# Altium schematic sheet 06_MSM8916_EBIO LPDDR3.SchDoc
size 868 x 576 mm
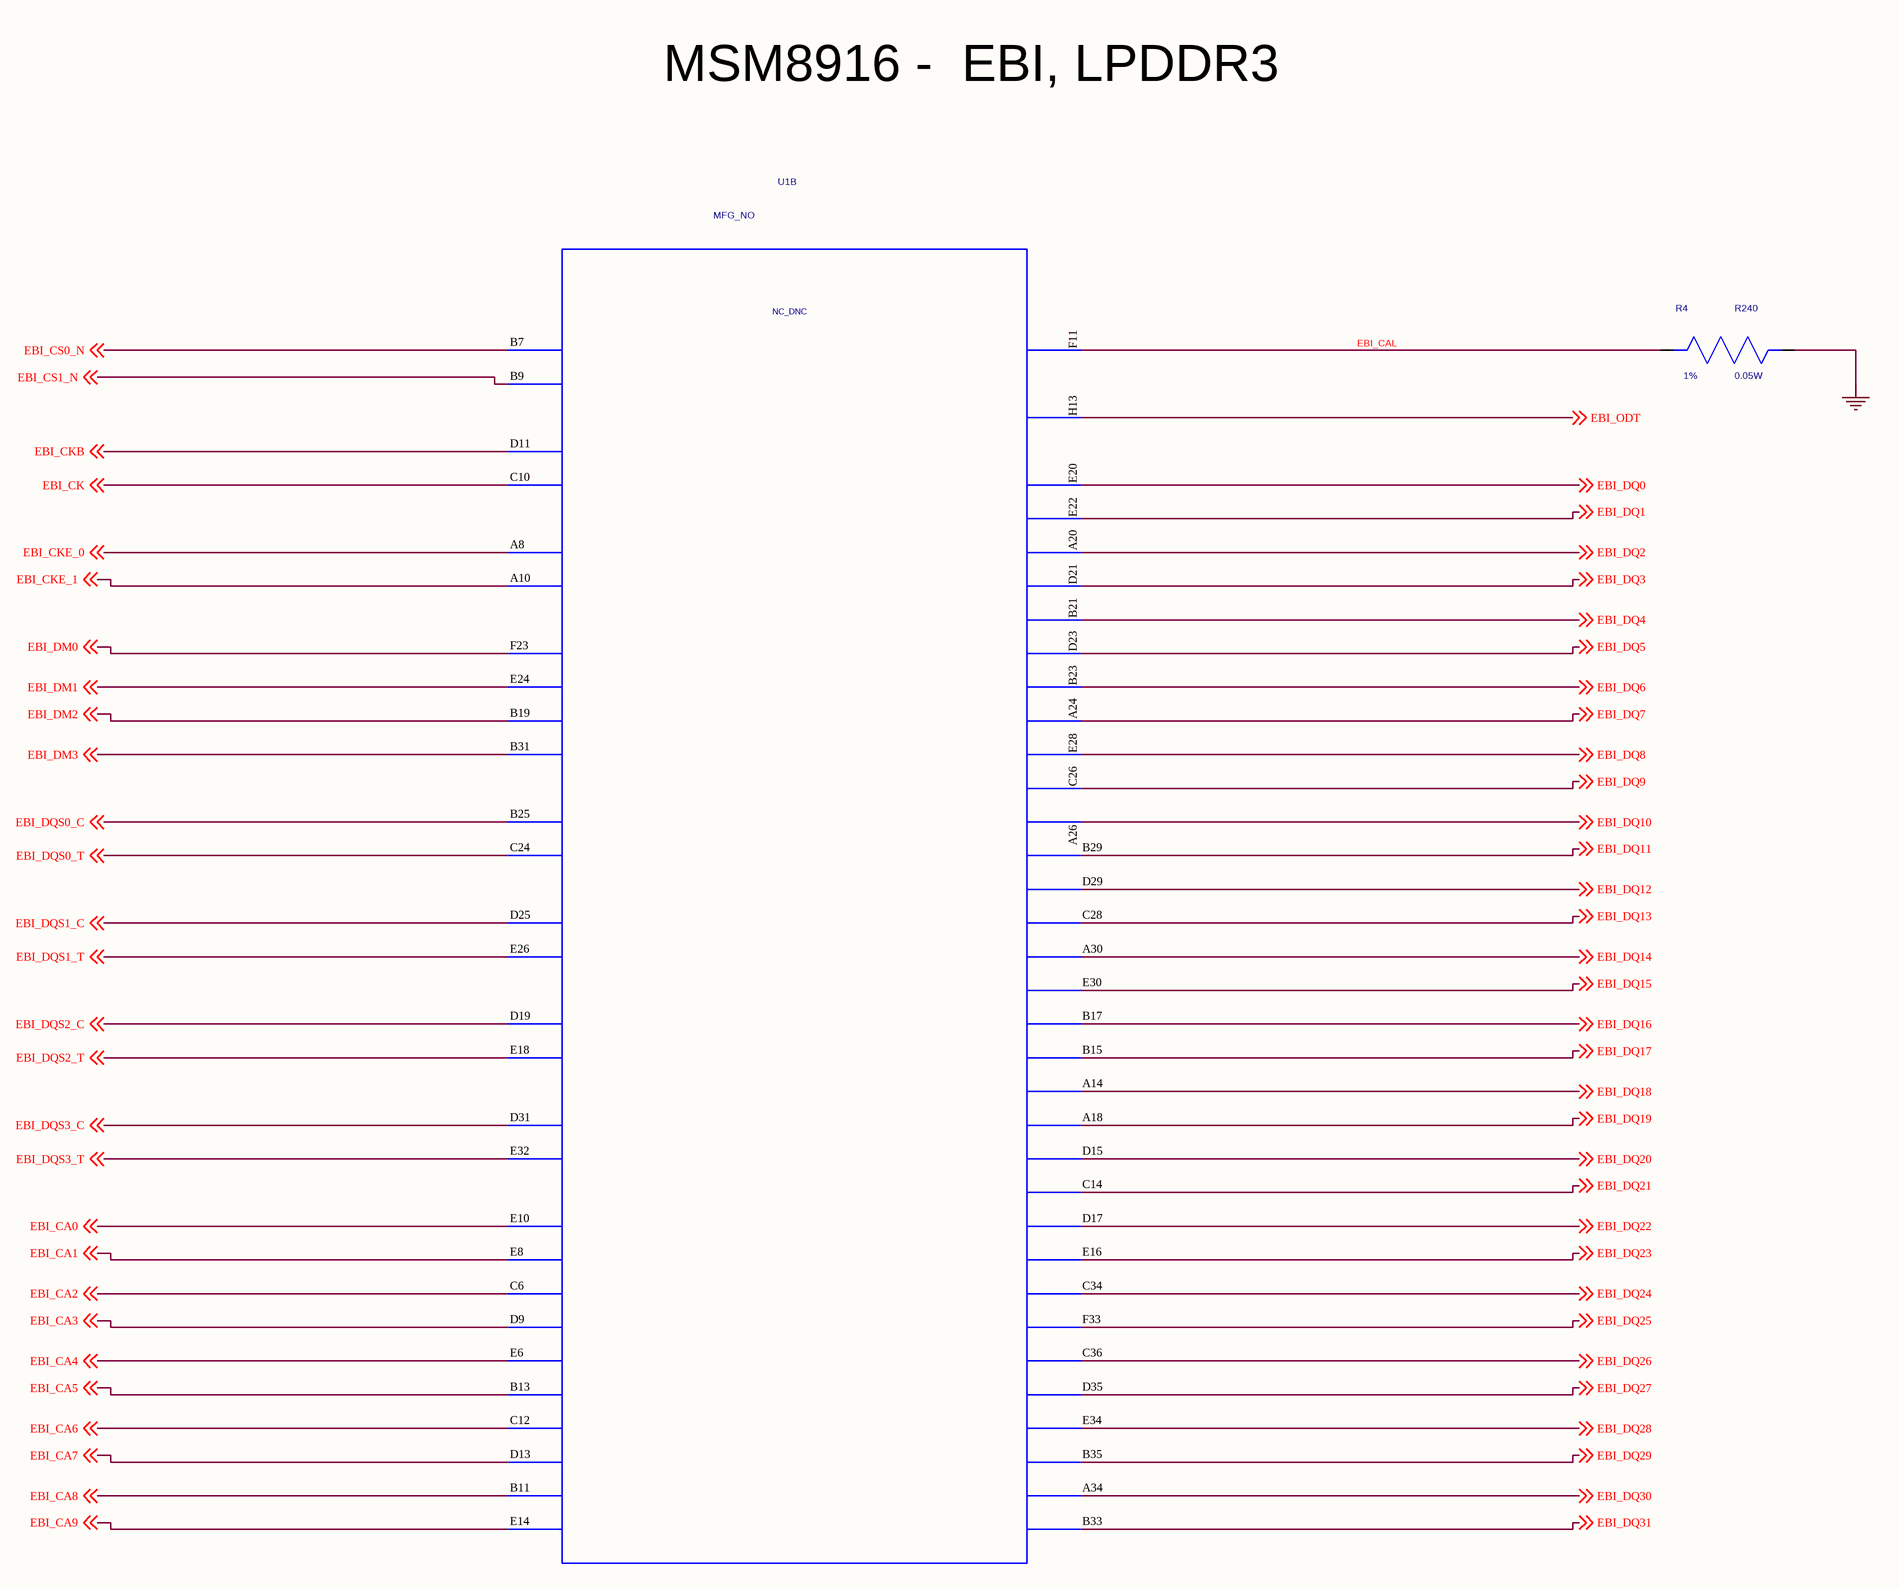
[diagram p0: 06_MSM8916_EBIO LPDDR3.SchDoc, top left]
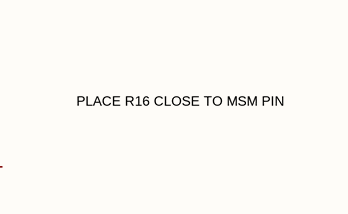
[diagram p1: 06_MSM8916_EBIO LPDDR3.SchDoc, top right]
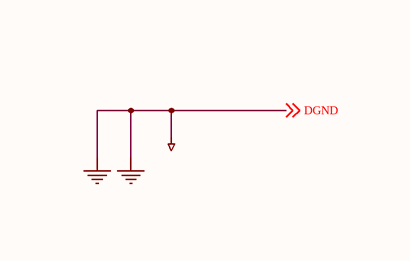
[diagram p2: 06_MSM8916_EBIO LPDDR3.SchDoc, bottom left]
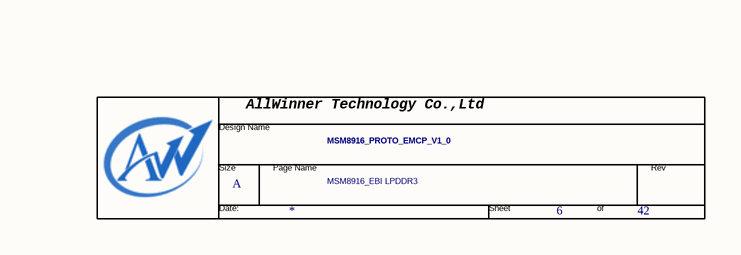
[diagram p3: 06_MSM8916_EBIO LPDDR3.SchDoc, bottom right]

## Parts
*  Page Count: 42  Page Number: 6  Page Size: A  Title: MSM8916_PROTO_EMCP_V1_0  Doc: MSM8916_EBI LPDDR3  (hidden comment: TitleBlock0-AW)  (graphical)
R4  R240  Tolerance: 1%  POWER: 0.05W
U1  SYMNAME: NC_DNC  PART_ID: MFG_NO  [MSM-8916-0-760NSP-TR-00-0]  (hidden comment: ASIC_MSM8936_760PIN)  (part B of 13)

## Nets
DGND: R4.2(NEG) ; off-sheet DGND  [also labelled GND]
EBI_CA0: U1.E10(EBI0_CA_0) ; off-sheet EBI_CA0
EBI_CA1: U1.E8(EBI0_CA_1) ; off-sheet EBI_CA1
EBI_CA2: U1.C6(EBI0_CA_2) ; off-sheet EBI_CA2
EBI_CA3: U1.D9(EBI0_CA_3) ; off-sheet EBI_CA3
EBI_CA4: U1.E6(EBI0_CA_4) ; off-sheet EBI_CA4
EBI_CA5: U1.B13(EBI0_CA_5) ; off-sheet EBI_CA5
EBI_CA6: U1.C12(EBI0_CA_6) ; off-sheet EBI_CA6
EBI_CA7: U1.D13(EBI0_CA_7) ; off-sheet EBI_CA7
EBI_CA8: U1.B11(EBI0_CA_8) ; off-sheet EBI_CA8
EBI_CA9: U1.E14(EBI0_CA_9) ; off-sheet EBI_CA9
EBI_CAL: R4.1(POS) U1.F11(EBI0_CAL)
EBI_CK: U1.C10(EBI0_CK) ; off-sheet EBI_CK
EBI_CKB: U1.D11(EBI0_CKB) ; off-sheet EBI_CKB
EBI_CKE_0: U1.A8(EBI0_CKE_0) ; off-sheet EBI_CKE_0
EBI_CKE_1: U1.A10(EBI0_CKE_1) ; off-sheet EBI_CKE_1
EBI_CS0_N: U1.B7(EBI0_CS_N_0) ; off-sheet EBI_CS0_N
EBI_CS1_N: U1.B9(EBI0_CS_N_1) ; off-sheet EBI_CS1_N
EBI_DM0: U1.F23(EBI0_DM_0) ; off-sheet EBI_DM0
EBI_DM1: U1.E24(EBI0_DM_1) ; off-sheet EBI_DM1
EBI_DM2: U1.B19(EBI0_DM_2) ; off-sheet EBI_DM2
EBI_DM3: U1.B31(EBI0_DM_3) ; off-sheet EBI_DM3
EBI_DQ0: U1.E20(EBI0_DQ_0) ; off-sheet EBI_DQ0
EBI_DQ1: U1.E22(EBI0_DQ_1) ; off-sheet EBI_DQ1
EBI_DQ2: U1.A20(EBI0_DQ_2) ; off-sheet EBI_DQ2
EBI_DQ3: U1.D21(EBI0_DQ_3) ; off-sheet EBI_DQ3
EBI_DQ4: U1.B21(EBI0_DQ_4) ; off-sheet EBI_DQ4
EBI_DQ5: U1.D23(EBI0_DQ_5) ; off-sheet EBI_DQ5
EBI_DQ6: U1.B23(EBI0_DQ_6) ; off-sheet EBI_DQ6
EBI_DQ7: U1.A24(EBI0_DQ_7) ; off-sheet EBI_DQ7
EBI_DQ8: U1.E28(EBI0_DQ_8) ; off-sheet EBI_DQ8
EBI_DQ9: U1.C26(EBI0_DQ_9) ; off-sheet EBI_DQ9
EBI_DQ10: U1.A26(EBI0_DQ_10) ; off-sheet EBI_DQ10
EBI_DQ11: U1.B29(EBI0_DQ_11) ; off-sheet EBI_DQ11
EBI_DQ12: U1.D29(EBI0_DQ_12) ; off-sheet EBI_DQ12
EBI_DQ13: U1.C28(EBI0_DQ_13) ; off-sheet EBI_DQ13
EBI_DQ14: U1.A30(EBI0_DQ_14) ; off-sheet EBI_DQ14
EBI_DQ15: U1.E30(EBI0_DQ_15) ; off-sheet EBI_DQ15
EBI_DQ16: U1.B17(EBI0_DQ_16) ; off-sheet EBI_DQ16
EBI_DQ17: U1.B15(EBI0_DQ_17) ; off-sheet EBI_DQ17
EBI_DQ18: U1.A14(EBI0_DQ_18) ; off-sheet EBI_DQ18
EBI_DQ19: U1.A18(EBI0_DQ_19) ; off-sheet EBI_DQ19
EBI_DQ20: U1.D15(EBI0_DQ_20) ; off-sheet EBI_DQ20
EBI_DQ21: U1.C14(EBI0_DQ_21) ; off-sheet EBI_DQ21
EBI_DQ22: U1.D17(EBI0_DQ_22) ; off-sheet EBI_DQ22
EBI_DQ23: U1.E16(EBI0_DQ_23) ; off-sheet EBI_DQ23
EBI_DQ24: U1.C34(EBI0_DQ_24) ; off-sheet EBI_DQ24
EBI_DQ25: U1.F33(EBI0_DQ_25) ; off-sheet EBI_DQ25
EBI_DQ26: U1.C36(EBI0_DQ_26) ; off-sheet EBI_DQ26
EBI_DQ27: U1.D35(EBI0_DQ_27) ; off-sheet EBI_DQ27
EBI_DQ28: U1.E34(EBI0_DQ_28) ; off-sheet EBI_DQ28
EBI_DQ29: U1.B35(EBI0_DQ_29) ; off-sheet EBI_DQ29
EBI_DQ30: U1.A34(EBI0_DQ_30) ; off-sheet EBI_DQ30
EBI_DQ31: U1.B33(EBI0_DQ_31) ; off-sheet EBI_DQ31
EBI_DQS0_C: U1.B25(EBI0_DQSB_0) ; off-sheet EBI_DQS0_C
EBI_DQS0_T: U1.C24(EBI0_DQS_0) ; off-sheet EBI_DQS0_T
EBI_DQS1_C: U1.D25(EBI0_DQSB_1) ; off-sheet EBI_DQS1_C
EBI_DQS1_T: U1.E26(EBI0_DQS_1) ; off-sheet EBI_DQS1_T
EBI_DQS2_C: U1.D19(EBI0_DQSB_2) ; off-sheet EBI_DQS2_C
EBI_DQS2_T: U1.E18(EBI0_DQS_2) ; off-sheet EBI_DQS2_T
EBI_DQS3_C: U1.D31(EBI0_DQSB_3) ; off-sheet EBI_DQS3_C
EBI_DQS3_T: U1.E32(EBI0_DQS_3) ; off-sheet EBI_DQS3_T
EBI_ODT: U1.H13(EBI0_ODT) ; off-sheet EBI_ODT

## Notes on the sheet
- MSM8916 -  EBI, LPDDR3
- PLACE R16 CLOSE TO MSM PIN
- (in symbol TitleBlock0-AW) AllWinner Technology Co.,Ltd; Design Name; Size; Page Name; Rev; Date:; Sheet; of

## Library data of the parts
R4 = RESISTOR_Dup3: PART_NUMBER: MCN_NO; PART_ID: MFG_NO; OriginalSymbolOrigin: (-200,50); CDS_LMAN_SYM_OUTLINE: -150,50,150,-50; SYMNAME: resistor; PACK_TYPE: ?
U1 = ASIC_MSM8936_760PIN: PART_NUMBER: MCN_NO; OriginalSymbolOrigin: (-1100,2500); SPLIT_INST: TRUE; CDS_LMAN_SYM_OUTLINE: -1050,2500,1050,-2500; CDS_LMAN_SPLIT_NUMBER: 1 of 13; PACK_TYPE: ?
* = TitleBlock0-AW: RevCode: ?; Page Create Date: March  8, 1995; Page Modify Date: *